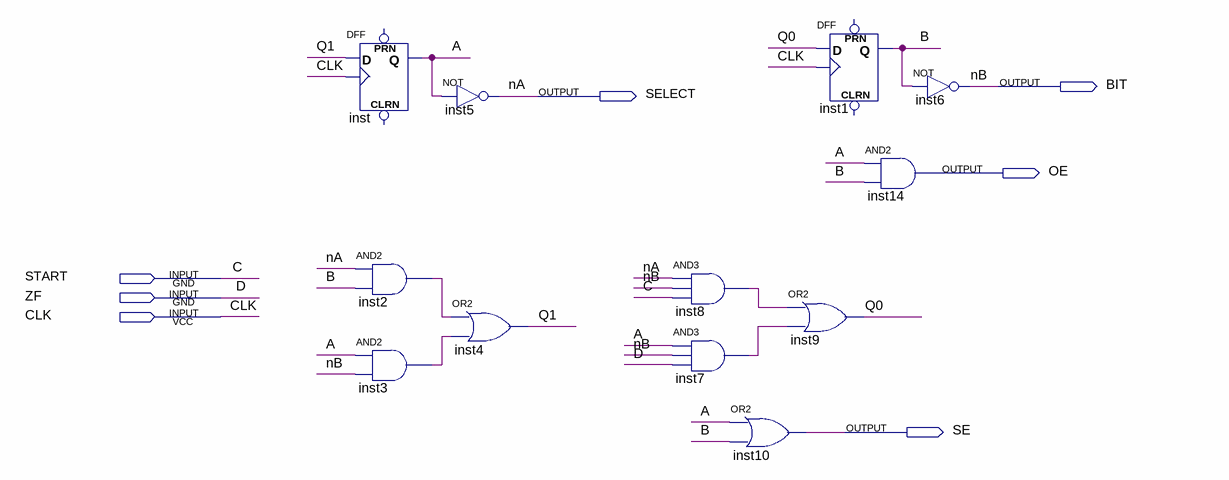
[diagram p0: schematic sheet]
// Quartus schematic CONTROL.bdf as structural Verilog: 12 symbols, 7 pins
module CONTROL (
  input  START,
  input  ZF,
  input  CLK,
  output BIT,
  output SELECT,
  output OE,
  output SE
);

  wire A, B, inst2_out, inst3_out, inst7_out, inst8_out, Q0, Q1;

  DFF inst (.CLK(CLK), .D(Q1), .Q(A));  // open: CLRN, PRN
  and inst2 (inst2_out, SELECT, B);
  and inst3 (inst3_out, A, BIT);
  not inst5 (SELECT, A);
  or inst4 (Q1, inst2_out, inst3_out);
  and inst8 (inst8_out, SELECT, BIT, START);
  and inst7 (inst7_out, A, BIT, ZF);
  or inst9 (Q0, inst8_out, inst7_out);
  or inst10 (SE, A, B);
  DFF inst1 (.CLK(CLK), .D(Q0), .Q(B));  // open: CLRN, PRN
  and inst14 (OE, A, B);
  not inst6 (BIT, B);

  // Other names for the same wires on the sheet: C = START; D = ZF; nA = SELECT; nB = BIT
endmodule
